# Altium project PSLink_v2.PrjPcb (part 2 of 2)

## Sheet power-sheet.SchDoc: Power Regulator
size 420 x 297 mm; CheckedBy: E.Orzes F.Martina S.Baron; CompanyName: CERN; DrawnBy: E.Orzes; Organization: CERN; Address1: European Organization for Nuclear Research; Address2: CH-1211 Genève 23 - Switzerland; Revision: 1.0; SheetNumber: 7; SheetTotal: 7; Projet: Phase Stable Link; DivGrp: EP-ESE; Designer: E.Orzes; ModifiedDate: -
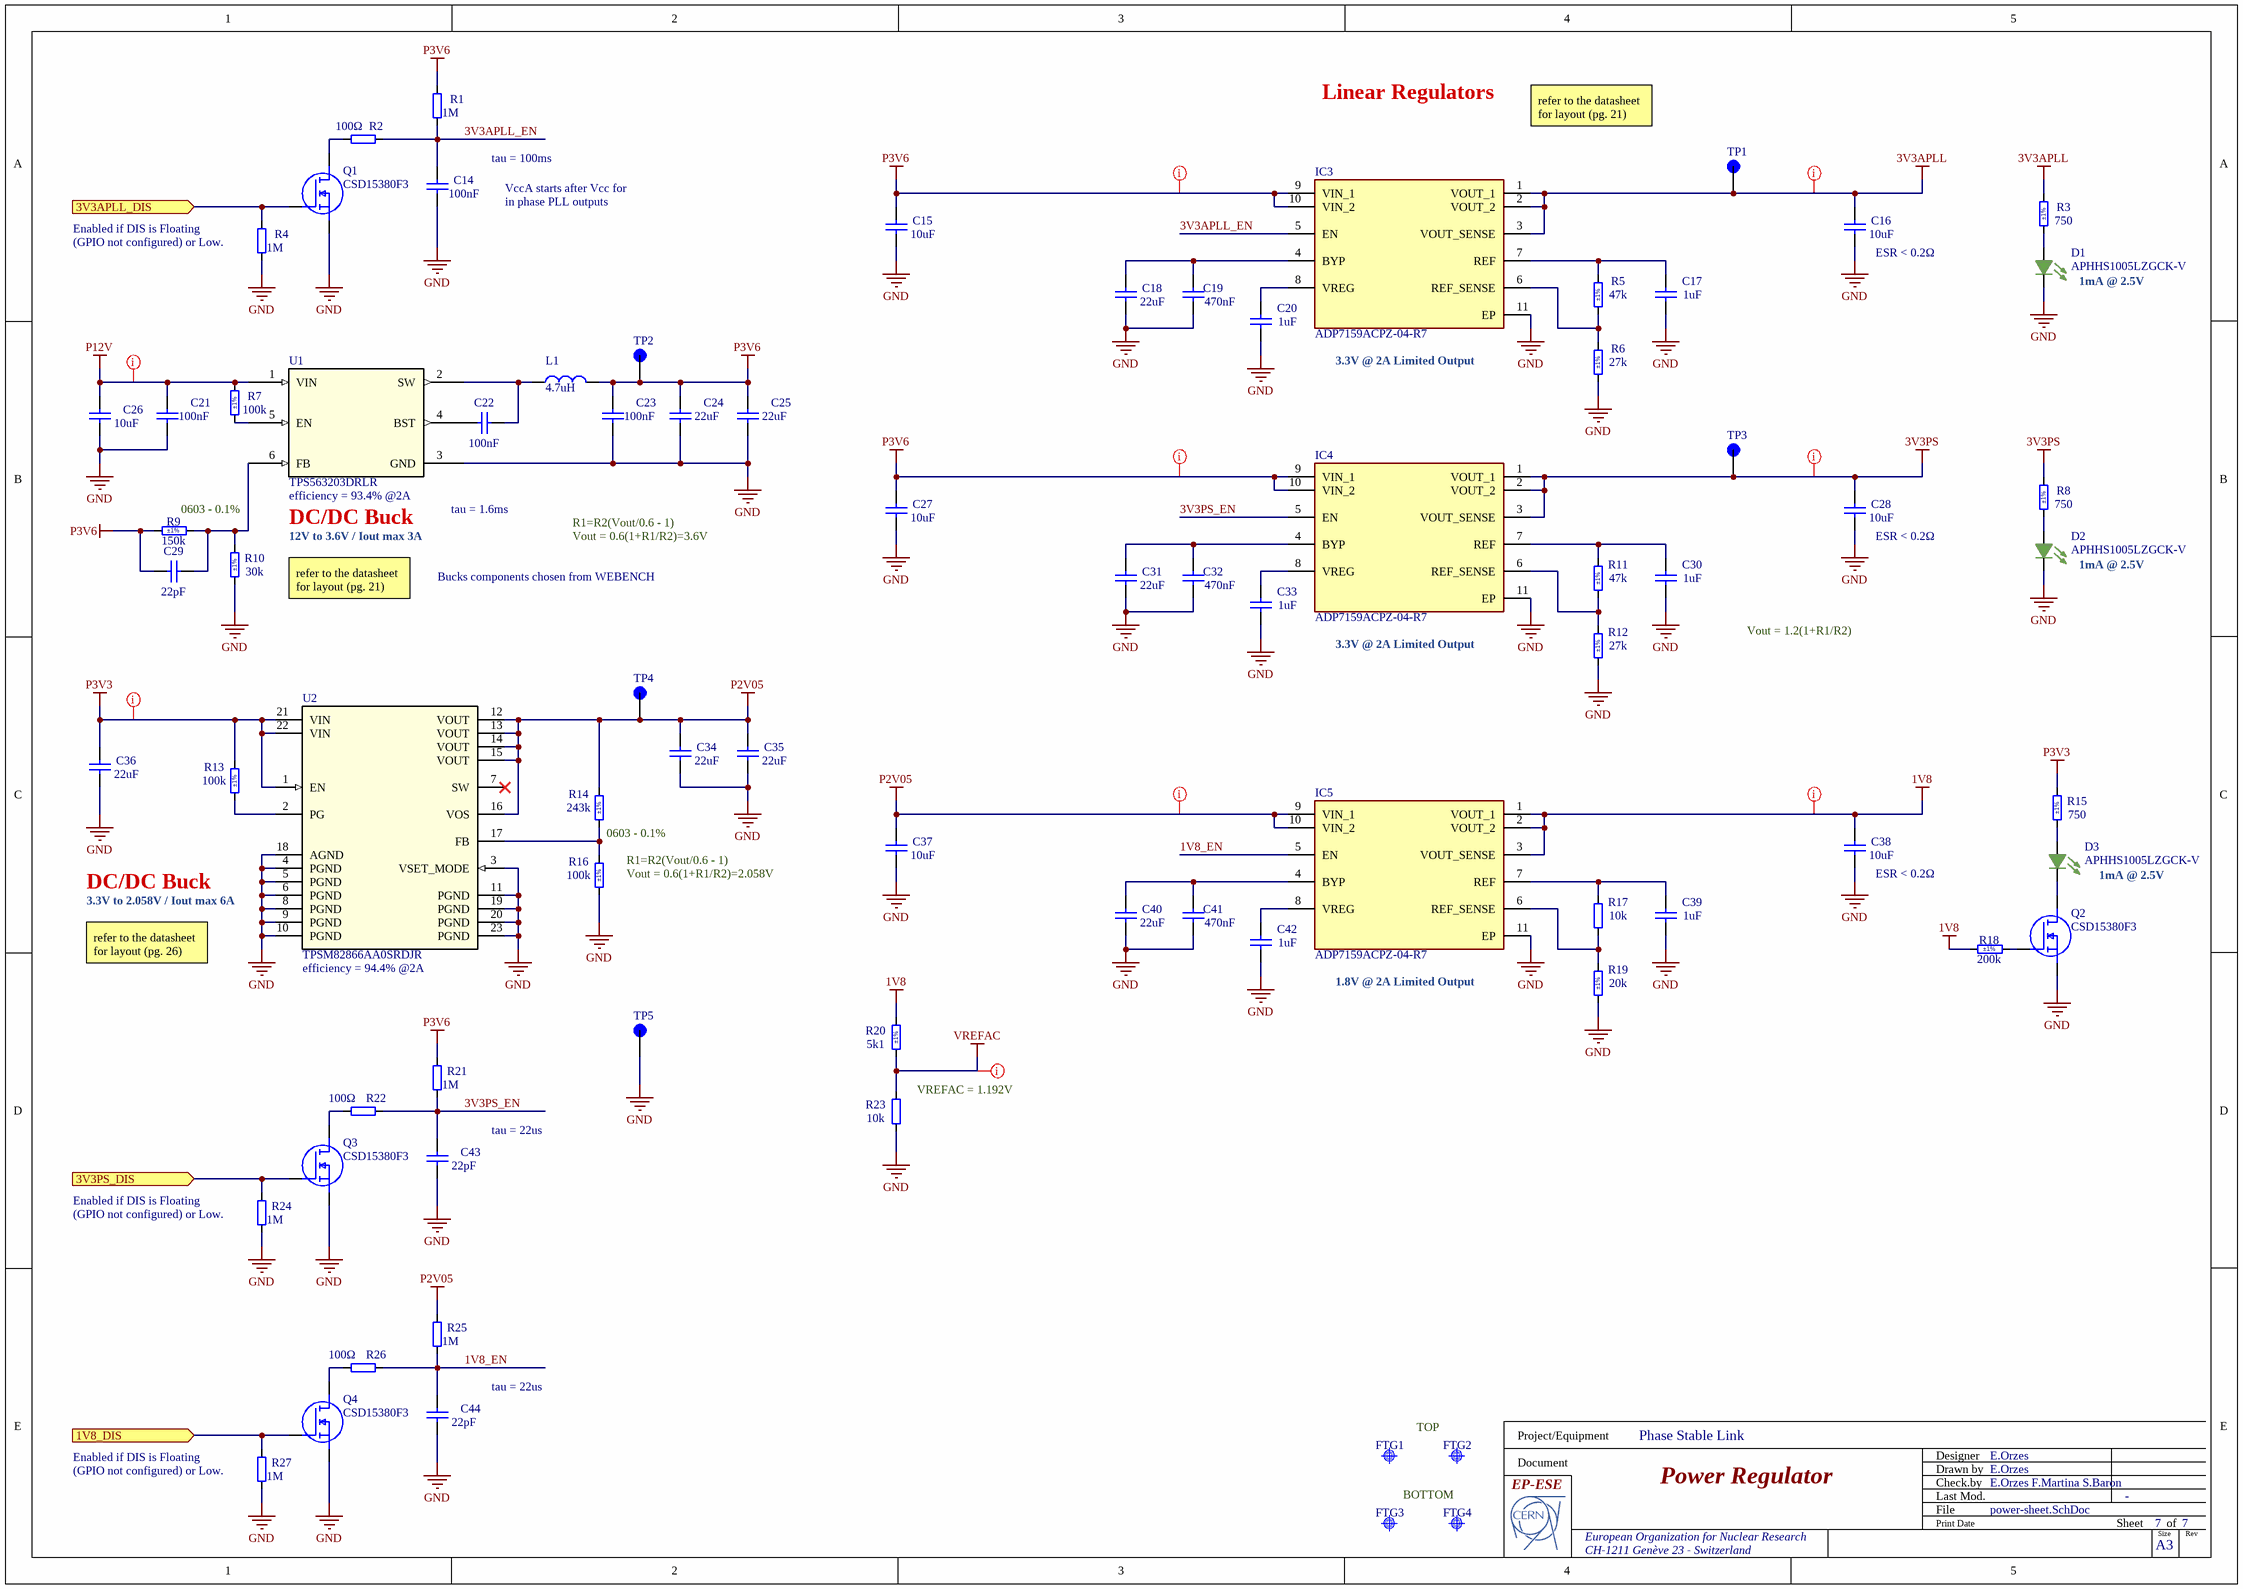
[diagram p4: power-sheet.SchDoc]

### Parts
C14  100nF  [MURATA_HI_DENSITY_0201]
C15  10uF  [CAPC1608X87N]
C16  10uF  [CAPC1608X87N]
C17  1uF  [CAPC1005X55N]
C18  22uF  [MURATA_HI_DENSITY_0402_CAP]
C19  470nF  [CAPC0510X04N]
C20  1uF  [CAPC1005X55N]
C21  100nF  [MURATA_HI_DENSITY_0402_CAP]
C22  100nF  [MURATA_HI_DENSITY_0402_CAP]
C23  100nF  [MURATA_HI_DENSITY_0402_CAP]
C24  22uF  [MURATA_HI_DENSITY_0402_CAP]
C25  22uF  [MURATA_HI_DENSITY_0402_CAP]
C26  10uF  [CAPC1608X87N]
C27  10uF  [CAPC1608X87N]
C28  10uF  [CAPC1608X87N]
C29  22pF  [MURATA_HI_DENSITY_0402_CAP]
C30  1uF  [CAPC1005X55N]
C31  22uF  [MURATA_HI_DENSITY_0402_CAP]
C32  470nF  [CAPC0510X04N]
C33  1uF  [CAPC1005X55N]
C34  22uF  [MURATA_HI_DENSITY_0402_CAP]
C35  22uF  [MURATA_HI_DENSITY_0402_CAP]
C36  22uF  [MURATA_HI_DENSITY_0402_CAP]
C37  10uF  [CAPC1608X87N]
C38  10uF  [CAPC1608X87N]
C39  1uF  [CAPC1005X55N]
C40  22uF  [MURATA_HI_DENSITY_0402_CAP]
C41  470nF  [CAPC0510X04N]
C42  1uF  [CAPC1005X55N]
C43  22pF  [MURATA_HI_DENSITY_0402_CAP]
C44  22pF  [MURATA_HI_DENSITY_0402_CAP]
D1  APHHS1005LZGCK-V  [LED_APHHS1005LZGCK-V]
D2  APHHS1005LZGCK-V  [LED_APHHS1005LZGCK-V]
D3  APHHS1005LZGCK-V  [LED_APHHS1005LZGCK-V]
FTG1  Use only in PCB  [FIDUCIAL_TOP_C100-200]  (value not drawn)
FTG2  Use only in PCB  [FIDUCIAL_TOP_C100-200]  (value not drawn)
FTG3  Use only in PCB  [FIDUCIAL_TOP_C100-200]  (value not drawn)
FTG4  Use only in PCB  [FIDUCIAL_TOP_C100-200]  (value not drawn)
IC3  ADP7159ACPZ-04-R7  [SON50P300X300X85-11N-D]
IC4  ADP7159ACPZ-04-R7  [SON50P300X300X85-11N-D]
IC5  ADP7159ACPZ-04-R7  [SON50P300X300X85-11N-D]
L1  4.7uH  [DFE322520FD1R0MP2]
Q1  CSD15380F3  [CSD15380F3]
Q2  CSD15380F3  [CSD15380F3]
Q3  CSD15380F3  [CSD15380F3]
Q4  CSD15380F3  [CSD15380F3]
R1  1M  [MURATA_HI_DENSITY_0201]
R2  100Ω  [MURATA_HI_DENSITY_0201]
R3  750  Tolerance: ±1%  [RESC1005X40N]
R4  1M  [MURATA_HI_DENSITY_0201]
R5  47k  Tolerance: ±1%  [RESC1005X40N]
R6  27k  Tolerance: ±1%  [RESC1005X40N]
R7  100k  Tolerance: ±1%  [RESC1608X55N]
R8  750  Tolerance: ±1%  [RESC1005X40N]
R9  150k  Tolerance: ±1%  [RESC1608X55N]
R10  30k  Tolerance: ±1%  [RESC1608X55N]
R11  47k  Tolerance: ±1%  [RESC1005X40N]
R12  27k  Tolerance: ±1%  [RESC1005X40N]
R13  100k  Tolerance: ±1%  [RESC1608X55N]
R14  243k  Tolerance: ±1%  [RESC1608X55N]
R15  750  Tolerance: ±1%  [RESC1005X40N]
R16  100k  Tolerance: ±1%  [RESC1608X55N]
R17  10k  [MURATA_HI_DENSITY_0201]
R18  200k  Tolerance: ±1%  [RESC1005X40N]
R19  20k  Tolerance: ±1%  [RESC1005X40N]
R20  5k1  Tolerance: ±1%  [RESC1005X40N]
R21  1M  [MURATA_HI_DENSITY_0201]
R22  100Ω  [MURATA_HI_DENSITY_0201]
R23  10k  [MURATA_HI_DENSITY_0201]
R24  1M  [MURATA_HI_DENSITY_0201]
R25  1M  [MURATA_HI_DENSITY_0201]
R26  100Ω  [MURATA_HI_DENSITY_0201]
R27  1M  [MURATA_HI_DENSITY_0201]
TP1  RCU-0C  [TP+195X110]  (value not drawn)
TP2  RCU-0C  [TP+195X110]  (value not drawn)
TP3  RCU-0C  [TP+195X110]  (value not drawn)
TP4  RCU-0C  [TP+195X110]  (value not drawn)
TP5  RCU-0C  [TP+195X110]  (value not drawn)
U1  TPS563203DRLR  [SOT_07SDRLR_TEX]
U2  TPSM82866AA0SRDJR  [RDJ0023A-MFG]

### Ports
1V8_DIS (in), 3V3APLL_DIS (in), 3V3PS_DIS (in)

### Nets
1V8: C38.2 IC5.1(VOUT_1) IC5.2(VOUT_2) IC5.3(VOUT_SENSE) R18.1 R20.2
3V3APLL: C16.2 IC3.1(VOUT_1) IC3.2(VOUT_2) IC3.3(VOUT_SENSE) R3.2 TP1.1(TP)
3V3PS: C28.2 IC4.1(VOUT_1) IC4.2(VOUT_2) IC4.3(VOUT_SENSE) R8.2 TP3.1(TP)
GND: C14.1 C15.1 C16.1 C17.1 C18.1 C19.1 C20.1 C21.2 C23.2 C24.1 C25.1 C26.1 C27.1 C28.1 C30.1 C31.1 C32.1 C33.1 C34.1 C35.1 C36.1 C37.1 C38.1 C39.1 C40.1 C41.1 C42.1 C43.2 C44.2 D1.1(C) D2.1(C) IC3.11(EP) IC4.11(EP) IC5.11(EP) Q1.2(S) Q2.2(S) Q3.2(S) Q4.2(S) R4.2 R6.1 R10.1 R12.1 R16.1 R19.1 R23.1 R24.2 R27.2 TP5.1(TP) U1.3(GND) U2.3(VSET_MODE) U2.4(PGND) U2.5(PGND) U2.6(PGND) U2.8(PGND) U2.9(PGND) U2.10(PGND) U2.11(PGND) U2.18(AGND) U2.19(PGND) U2.20(PGND) U2.23(PGND)
P2V05: C34.2 C35.2 C37.2 IC5.9(VIN_1) IC5.10(VIN_2) R14.2 R25.1 TP4.1(TP) U2.12(VOUT) U2.13(VOUT) U2.14(VOUT) U2.15(VOUT) U2.16(VOS)
P3V3: C36.2 R13.2 R15.2 U2.1(EN) U2.21(VIN) U2.22(VIN)
P3V6: C15.2 C23.1 C24.2 C25.2 C27.2 C29.2 IC3.9(VIN_1) IC3.10(VIN_2) IC4.9(VIN_1) IC4.10(VIN_2) L1.2 R1.1 R9.1 R21.1 TP2.1(TP)
P12V: C21.1 C26.2 R7.2 U1.1(VIN)
VREFAC: R20.1 R23.2
1V8_DIS: Q4.1(G) R27.1 ; port 1V8_DIS
1V8_EN: C44.1 IC5.5(EN) R25.2 R26.2
3V3_APLL_DIS: Q1.1(G) R4.1 ; port 3V3APLL_DIS
3V3_PS_DIS: Q3.1(G) R24.1 ; port 3V3PS_DIS
3V3APLL_EN: C14.2 IC3.5(EN) R1.2 R2.2
3V3PS_EN: C43.1 IC4.5(EN) R21.2 R22.2
NetC17_2: C17.2 IC3.7(REF) R5.2
NetC18_2: C18.2 C19.2 IC3.4(BYP)
NetC20_2: C20.2 IC3.8(VREG)
NetC22_1: C22.1 L1.1 U1.2(SW)
NetC22_2: C22.2 U1.4(BST)
NetC29_1: C29.1 R9.2 R10.2 U1.6(FB)
NetC30_2: C30.2 IC4.7(REF) R11.2
NetC31_2: C31.2 C32.2 IC4.4(BYP)
NetC33_2: C33.2 IC4.8(VREG)
NetC39_2: C39.2 IC5.7(REF) R17.2
NetC40_2: C40.2 C41.2 IC5.4(BYP)
NetC42_2: C42.2 IC5.8(VREG)
NetD1_2: D1.2(A) R3.1
NetD2_2: D2.2(A) R8.1
NetD3_1: D3.1(C) Q2.3(D)
NetD3_2: D3.2(A) R15.1
NetIC3_6: IC3.6(REF_SENSE) R5.1 R6.2
NetIC4_6: IC4.6(REF_SENSE) R11.1 R12.2
NetIC5_6: IC5.6(REF_SENSE) R17.1 R19.2
NetQ1_3: Q1.3(D) R2.1
NetQ2_1: Q2.1(G) R18.2
NetQ3_3: Q3.3(D) R22.1
NetQ4_3: Q4.3(D) R26.1
NetR7_1: R7.1 U1.5(EN)
NetR13_1: R13.1 U2.2(PG)
NetR14_1: R14.1 R16.2 U2.17(FB)

Not connected (* = marked no-connect by the designer): U2 7(SW)*

### Layout directives
net class Power: 1V8, 3V3APLL, 3V3PS, P2V05, P3V3, P3V6, P12V, VREFAC

### Notes on the sheet
- Linear Regulators
- refer to the datasheet for layout (pg. 21)
- tau = 100ms
- (near R4) Enabled if DIS is Floating (GPIO not configured) or Low.
- VccA starts after Vcc for in phase PLL outputs
- (near C16) ESR < 0.2Ω
- 1mA @ 2.5V
- (near IC3) 3.3V @ 2A Limited Output
- (near R9) 0603 - 0.1%
- DC/DC Buck
- (near U1) efficiency = 93.4% @2A
- (near U1) tau = 1.6ms
- R1=R2(Vout/0.6 - 1)
- 12V to 3.6V / Iout max 3A
- Bucks components chosen from WEBENCH
- Vout = 0.6(1+R1/R2)=3.6V
- (near C28) ESR < 0.2Ω
- (near IC4) 3.3V @ 2A Limited Output
- Vout = 1.2(1+R1/R2)
- (near R14) 0603 - 0.1%
- (near U2) 3.3V to 2.058V / Iout max 6A
- (near R16) Vout = 0.6(1+R1/R2)=2.058V
- (near C38) ESR < 0.2Ω
- refer to the datasheet for layout (pg. 26)
- (near U2) efficiency = 94.4% @2A
- (near IC5) 1.8V @ 2A Limited Output
- tau = 22us
- (near R23) VREFAC = 1.192V
- (near R24) Enabled if DIS is Floating (GPIO not configured) or Low.
- TOP
- (near R27) Enabled if DIS is Floating (GPIO not configured) or Low.
- BOTTOM
- Project/Equipment
- Document
- Designer
- Drawn by
- Check.by
- File
- Last Mod.
- Print Date
- Sheet
- Size
- A3
- of
- Rev

### Library data of the parts
C14 = C0201-100nF-high-density: GRM033R61C104KE14; Vmax: 16V; Value: 100nF
C15 C16 C26-C28 C37 C38 = CC0603_10UF_6.3V_20%_X5R: as C101 on sheet PLL; Part Number: CC0603_10UF_6.3V_20%_X5R; Component Kind: Standard; Component Type: Standard; Pin Count: 2; Value: 10uF; Status: Preferred; Manufacturer Part Number: CC0603_10uF_6.3V_20%_X5R; Case: 0603; Mounted: Yes; Socket: No; SMD: Yes; Sense: No; Manufacturer1 Example: KEMET; Manufacturer1 ComponentHeight: 0.95mm; HelpURL: \\cern.ch\dfs\Applications\Altium\Datasheets\CC0603_X5R_KEMET.pdf; Author: CERN DEM JLC; CreateDate: 03/12/2007; LatestRevisionDate: 03/12/2007
C17 C20 C30 C33 C39 C42 = CC0402_1UF_16V_10%_X5R: GRM153B30J105ME15; Part Description: SMD Multilayer Chip Ceramic Capacitor; Manufacturer: GENERIC; Manufacturer1 Part Number: C1005X5R1C105KT; Voltage: 16V; TC: X5R; Tolerance: ±10%; Part Number: CC0402_1UF_16V_10%_X5R; Component Kind: Standard; Component Type: Standard; Pin Count: 2; Value: 1uF; Status: Preferred; Manufacturer Part Number: CC0402_1UF_16V_10%_X5R; Case: 0402; Mounted: Yes; Socket: No; SMD: Yes; Sense: No; Manufacturer1 Example: TDK; Manufacturer1 ComponentHeight: 0.55mm; HelpURL: \\cern.ch\dfs\Applications\Altium\Datasheets\CC0402_X5R_TDK_C.pdf; Author: CERN DEM JLC; CreateDate: 10/25/2012; LatestRevisionDate: 10/25/2012
C18 C24 C25 C31 C34-C36 C40 = C0402-22uF-high-density: GRM155R60J226ME11; Vmax: 6.3V; Value: 22uF
C19 C32 C41 = Capacitor - non polarized: LLL153C70G474ME17; Value: 470nF
C21-C23 = C0402-22uF-high-density: GRM155R71E104KE14; Value: 22uF; Vmax: 6.3V
C29 C43 C44 = C0402-22uF-high-density: C0402C220J4GACTU; Value: 22uF; Vmax: 6.3V
D1-D3 = APHHS1005LZGCK-V: Led Green 0402 2mA 2.65V 40mcd 102mW; MF: Kingbright Corporation; SnapEDA_Link: https://www.snapeda.com/parts/APHHS1005LZGCK-V/Kingbright/view-part/?ref=snap; Package: 0402 Kingbright Corporation; Value: *; MP: APHHS1005LZGCK-V; Check_prices: https://www.snapeda.com/parts/APHHS1005LZGCK-V/Kingbright/view-part/?ref=eda
FTG1-FTG4 = FIDUCIAL_TARGET_C100-200: Fiducial Target; Part Description: Round Fiducial Target, Top Layer, 1.0mm, Top Solder 2.0mm, Keepout =2.0mm; Mounted: No; Part Number: FIDUCIAL_TARGET_C100-200; Component Kind: Standard (No BOM); Component Type: Standard (No BOM); Pin Count: 1; Family: Fiducial; Socket: No; SMD: Yes; Sense: No; Status: None; ComponentHeight: 0mm; HelpURL: Undefined; Author: CERN DEM JLC; CreateDate: 09/02/2010; LatestRevisionDate: 04/04/2012; PackageDescription: Round Fiducial Target, Top Layer, 1.0mm, Top Solder 2.0mm, Keepout =2.0mm
IC3-IC5 = ADP7159ACPZ-04-R7: Integrated Circuit; Manufacturer_Name: Analog Devices; Datasheet Link: https://www.analog.com/media/en/technical-documentation/data-sheets/ADP7159.pdf; Height: 0.85mm; Manufacturer_Part_Number: ADP7159ACPZ-04-R7; Mouser Part Number: 584-ADP7159ACPZ04R7; Mouser Price/Stock: https://www.mouser.co.uk/ProductDetail/Analog-Devices/ADP7159ACPZ-04-R7?qs=JeIcUl65ClBXEAZRPtHUVQ%3D%3D; Arrow Part Number: ADP7159ACPZ-04-R7; Arrow Price/Stock: https://www.arrow.com/en/products/adp7159acpz-04-r7/analog-devices
L1 = DFE322520FD-4R7M=P2: Inductor; Manufacturer_Name: Murata Electronics; Datasheet Link: https://search.murata.co.jp/Ceramy/image/img/P02/J(E)TE243A-9104.pdf; Height: 2mm; Manufacturer_Part_Number: DFE322520FD-4R7M=P2; Mouser Part Number: 81-DFE322520FD4R7MP2; Mouser Price/Stock: https://www.mouser.co.uk/ProductDetail/Murata-Electronics/DFE322520FD-4R7M%3dP2?qs=17u8i%2FzlE8%252BgAY54mivQ1g%3D%3D; Arrow Part Number: DFE322520FD-4R7M=P2; Arrow Price/Stock: https://www.arrow.com/en/products/dfe322520fd-4r7mp2/murata-manufacturing?region=nac
Q1-Q4 = CSD15380F3: MOSFET (N-Channel); Manufacturer_Name: Texas Instruments; Datasheet Link: https://www.ti.com/lit/ds/symlink/csd15380f3.pdf?ts=1641221366106&ref_url=https%253A%252F%252Fwww.google.com%252F; Height: 0.35mm; Manufacturer_Part_Number: CSD15380F3; Mouser Part Number: 595-CSD15380F3; Mouser Price/Stock: https://www.mouser.co.uk/ProductDetail/Texas-Instruments/CSD15380F3?qs=zEmsApcVOkXP46xhm0edmA%3D%3D; Arrow Part Number: CSD15380F3; Arrow Price/Stock: https://www.arrow.com/en/products/csd15380f3/texas-instruments?region=nac
R1 R4 R17 R21 R23-R25 R27 = R0201-100ohm-high-density: Resistor 10k; Value: 100Ω
R2 R22 R26 = R0201-100ohm-high-density: Resistor; Value: 100Ω
R3 R8 R15 = R0402_750R_1%_0.0625W_100PPM: Resistor - 1%; Part Description: General Purpose Thick Film Chip Resistor; Manufacturer: GENERIC; Manufacturer1 Part Number: 232270677501L; TC: ±100ppm/°C; PressFit: No; Part Number: R0402_750R_1%_0.0625W_100PPM; Component Kind: Standard; Component Type: Standard; Pin Count: 2; Value: 750; Status: Not Recommended; Power: 0.0625W; Manufacturer Part Number: R0402_750R_1%_0.0625W_100PPM; Case: 0402; Mounted: Yes; Sense: No; Socket: No; SMD: Yes; Manufacturer1 Example: YAGEO PHYCOMP; Manufacturer1 ComponentHeight: 0.4mm; HelpURL: \\cern.ch\dfs\Applications\Altium\Datasheets\R0402_Phycomp_RC0402.pdf; Author: CERN DEM JLC; CreateDate: 12/3/2007; LatestRevisionDate: 10/17/2012
R5 R11 = R0402_47K_1%_0.0625W_100PPM: Resistor - 1%; Part Description: General Purpose Thick Film Chip Resistor; Manufacturer: GENERIC; Manufacturer1 Part Number: 232270674703L; TC: ±100ppm/°C; PressFit: No; Part Number: R0402_47K_1%_0.0625W_100PPM; Component Kind: Standard; Component Type: Standard; Pin Count: 2; Value: 47k; Status: Not Recommended; Power: 0.0625W; Manufacturer Part Number: R0402_47K_1%_0.0625W_100PPM; Case: 0402; Mounted: Yes; Sense: No; Socket: No; SMD: Yes; Manufacturer1 Example: YAGEO PHYCOMP; Manufacturer1 ComponentHeight: 0.4mm; HelpURL: \\cern.ch\dfs\Applications\Altium\Datasheets\R0402_Phycomp_RC0402.pdf; Author: CERN DEM JLC; CreateDate: 12/3/2007; LatestRevisionDate: 10/17/2012
R6 R12 = R0402_27K_1%_0.0625W_100PPM: Resistor - 1%; Part Description: General Purpose Thick Film Chip Resistor; Manufacturer: GENERIC; Manufacturer1 Part Number: 232270672703L; TC: ±100ppm/°C; PressFit: No; Part Number: R0402_27K_1%_0.0625W_100PPM; Component Kind: Standard; Component Type: Standard; Pin Count: 2; Value: 27k; Status: Not Recommended; Power: 0.0625W; Manufacturer Part Number: R0402_27K_1%_0.0625W_100PPM; Case: 0402; Mounted: Yes; Sense: No; Socket: No; SMD: Yes; Manufacturer1 Example: YAGEO PHYCOMP; Manufacturer1 ComponentHeight: 0.4mm; HelpURL: \\cern.ch\dfs\Applications\Altium\Datasheets\R0402_Phycomp_RC0402.pdf; Author: CERN DEM JLC; CreateDate: 12/3/2007; LatestRevisionDate: 10/17/2012
R7 R13 R14 R16 = R0603_30K_1%_0.1W_100PPM: Resistor - 1%; Part Description: General Purpose Thick Film Chip Resistor; Manufacturer: GENERIC; Manufacturer1 Part Number: NRC06F3002TRF; Value: 30k; Power: 0.1W; TC: ±100ppm/°C; PressFit: No; Part Number: R0603_30K_1%_0.1W_100PPM; Component Kind: Standard; Component Type: Standard; Pin Count: 2; Status: Preferred; Manufacturer Part Number: R0603_30K_1%_0.1W_100PPM; Case: 0603; Mounted: Yes; Sense: No; Socket: No; SMD: Yes; Manufacturer1 Example: NIC COMPONENT; Manufacturer1 ComponentHeight: 0.55mm; HelpURL: \\cern.ch\dfs\Applications\Altium\Datasheets\R0603_NIC_NRC.pdf; Author: CERN DEM JLC; CreateDate: 12/3/2007; LatestRevisionDate: 3/13/2008
R9 = R0603_150K_1%_0.1W_100PPM: Resistor - 1%; Part Description: General Purpose Thick Film Chip Resistor; Manufacturer: GENERIC; Manufacturer1 Part Number: NRC06F1503TRF; Power: 0.1W; TC: ±100ppm/°C; PressFit: No; Part Number: R0603_150K_1%_0.1W_100PPM; Component Kind: Standard; Component Type: Standard; Pin Count: 2; Value: 150k; Status: Preferred; Manufacturer Part Number: R0603_150K_1%_0.1W_100PPM; Case: 0603; Mounted: Yes; Sense: No; Socket: No; SMD: Yes; Manufacturer1 Example: NIC COMPONENT; Manufacturer1 ComponentHeight: 0.55mm; HelpURL: \\cern.ch\dfs\Applications\Altium\Datasheets\R0603_NIC_NRC.pdf; Author: CERN DEM JLC; CreateDate: 12/3/2007; LatestRevisionDate: 3/13/2008
R10 = R0603_30K_1%_0.1W_100PPM: Resistor - 1%; Part Description: General Purpose Thick Film Chip Resistor; Manufacturer: GENERIC; Manufacturer1 Part Number: NRC06F3002TRF; Power: 0.1W; TC: ±100ppm/°C; PressFit: No; Part Number: R0603_30K_1%_0.1W_100PPM; Component Kind: Standard; Component Type: Standard; Pin Count: 2; Value: 30k; Status: Preferred; Manufacturer Part Number: R0603_30K_1%_0.1W_100PPM; Case: 0603; Mounted: Yes; Sense: No; Socket: No; SMD: Yes; Manufacturer1 Example: NIC COMPONENT; Manufacturer1 ComponentHeight: 0.55mm; HelpURL: \\cern.ch\dfs\Applications\Altium\Datasheets\R0603_NIC_NRC.pdf; Author: CERN DEM JLC; CreateDate: 12/3/2007; LatestRevisionDate: 3/13/2008
R18 = R0402_200K_1%_0.0625W_100PPM: Resistor - 1%; Part Description: General Purpose Thick Film Chip Resistor; Manufacturer: GENERIC; Manufacturer1 Part Number: 232270672004L; TC: ±100ppm/°C; PressFit: No; Part Number: R0402_200K_1%_0.0625W_100PPM; Component Kind: Standard; Component Type: Standard; Pin Count: 2; Value: 200k; Status: Not Recommended; Power: 0.0625W; Manufacturer Part Number: R0402_200K_1%_0.0625W_100PPM; Case: 0402; Mounted: Yes; Sense: No; Socket: No; SMD: Yes; Manufacturer1 Example: YAGEO PHYCOMP; Manufacturer1 ComponentHeight: 0.4mm; HelpURL: \\cern.ch\dfs\Applications\Altium\Datasheets\R0402_Phycomp_RC0402.pdf; Author: CERN DEM JLC; CreateDate: 12/3/2007; LatestRevisionDate: 10/17/2012
R19 = R0402_20K_1%_0.0625W_100PPM: Resistor - 1%; Part Description: General Purpose Thick Film Chip Resistor; Manufacturer: GENERIC; Manufacturer1 Part Number: 232270672003L; TC: ±100ppm/°C; PressFit: No; Part Number: R0402_20K_1%_0.0625W_100PPM; Component Kind: Standard; Component Type: Standard; Pin Count: 2; Value: 20k; Status: Not Recommended; Power: 0.0625W; Manufacturer Part Number: R0402_20K_1%_0.0625W_100PPM; Case: 0402; Mounted: Yes; Sense: No; Socket: No; SMD: Yes; Manufacturer1 Example: YAGEO PHYCOMP; Manufacturer1 ComponentHeight: 0.4mm; HelpURL: \\cern.ch\dfs\Applications\Altium\Datasheets\R0402_Phycomp_RC0402.pdf; Author: CERN DEM JLC; CreateDate: 12/3/2007; LatestRevisionDate: 10/17/2012
R20 = R0402_5K1_1%_0.0625W_100PPM: Resistor - 1%; Part Description: General Purpose Thick Film Chip Resistor; Manufacturer: GENERIC; Manufacturer1 Part Number: 232270675102L; TC: ±100ppm/°C; PressFit: No; Part Number: R0402_5K1_1%_0.0625W_100PPM; Component Kind: Standard; Component Type: Standard; Pin Count: 2; Value: 5k1; Status: Not Recommended; Power: 0.0625W; Manufacturer Part Number: R0402_5K1_1%_0.0625W_100PPM; Case: 0402; Mounted: Yes; Sense: No; Socket: No; SMD: Yes; Manufacturer1 Example: YAGEO PHYCOMP; Manufacturer1 ComponentHeight: 0.4mm; HelpURL: \\cern.ch\dfs\Applications\Altium\Datasheets\R0402_Phycomp_RC0402.pdf; Author: CERN DEM JLC; CreateDate: 03/12/2007; LatestRevisionDate: 17/10/2012
TP1-TP5 = RCU-0C: as TP9 on sheet PLL; Package: None; Price: None; Value: *; MP: RCU-0C; Availability: Unavailable
U1 = TPS563203DRLR: No Description Available; Mfr_Name: Texas Instruments; Type: Power Management; RefDes: RefDes
U2 = XPSM82866AA0SRDJR: No Description Available; Mfr_Name: Texas Instruments; TYPE: TYPE; RefDes: RefDes

## Sheet FMC.SchDoc
size 420 x 297 mm; SheetNumber: 4; SheetTotal: 7
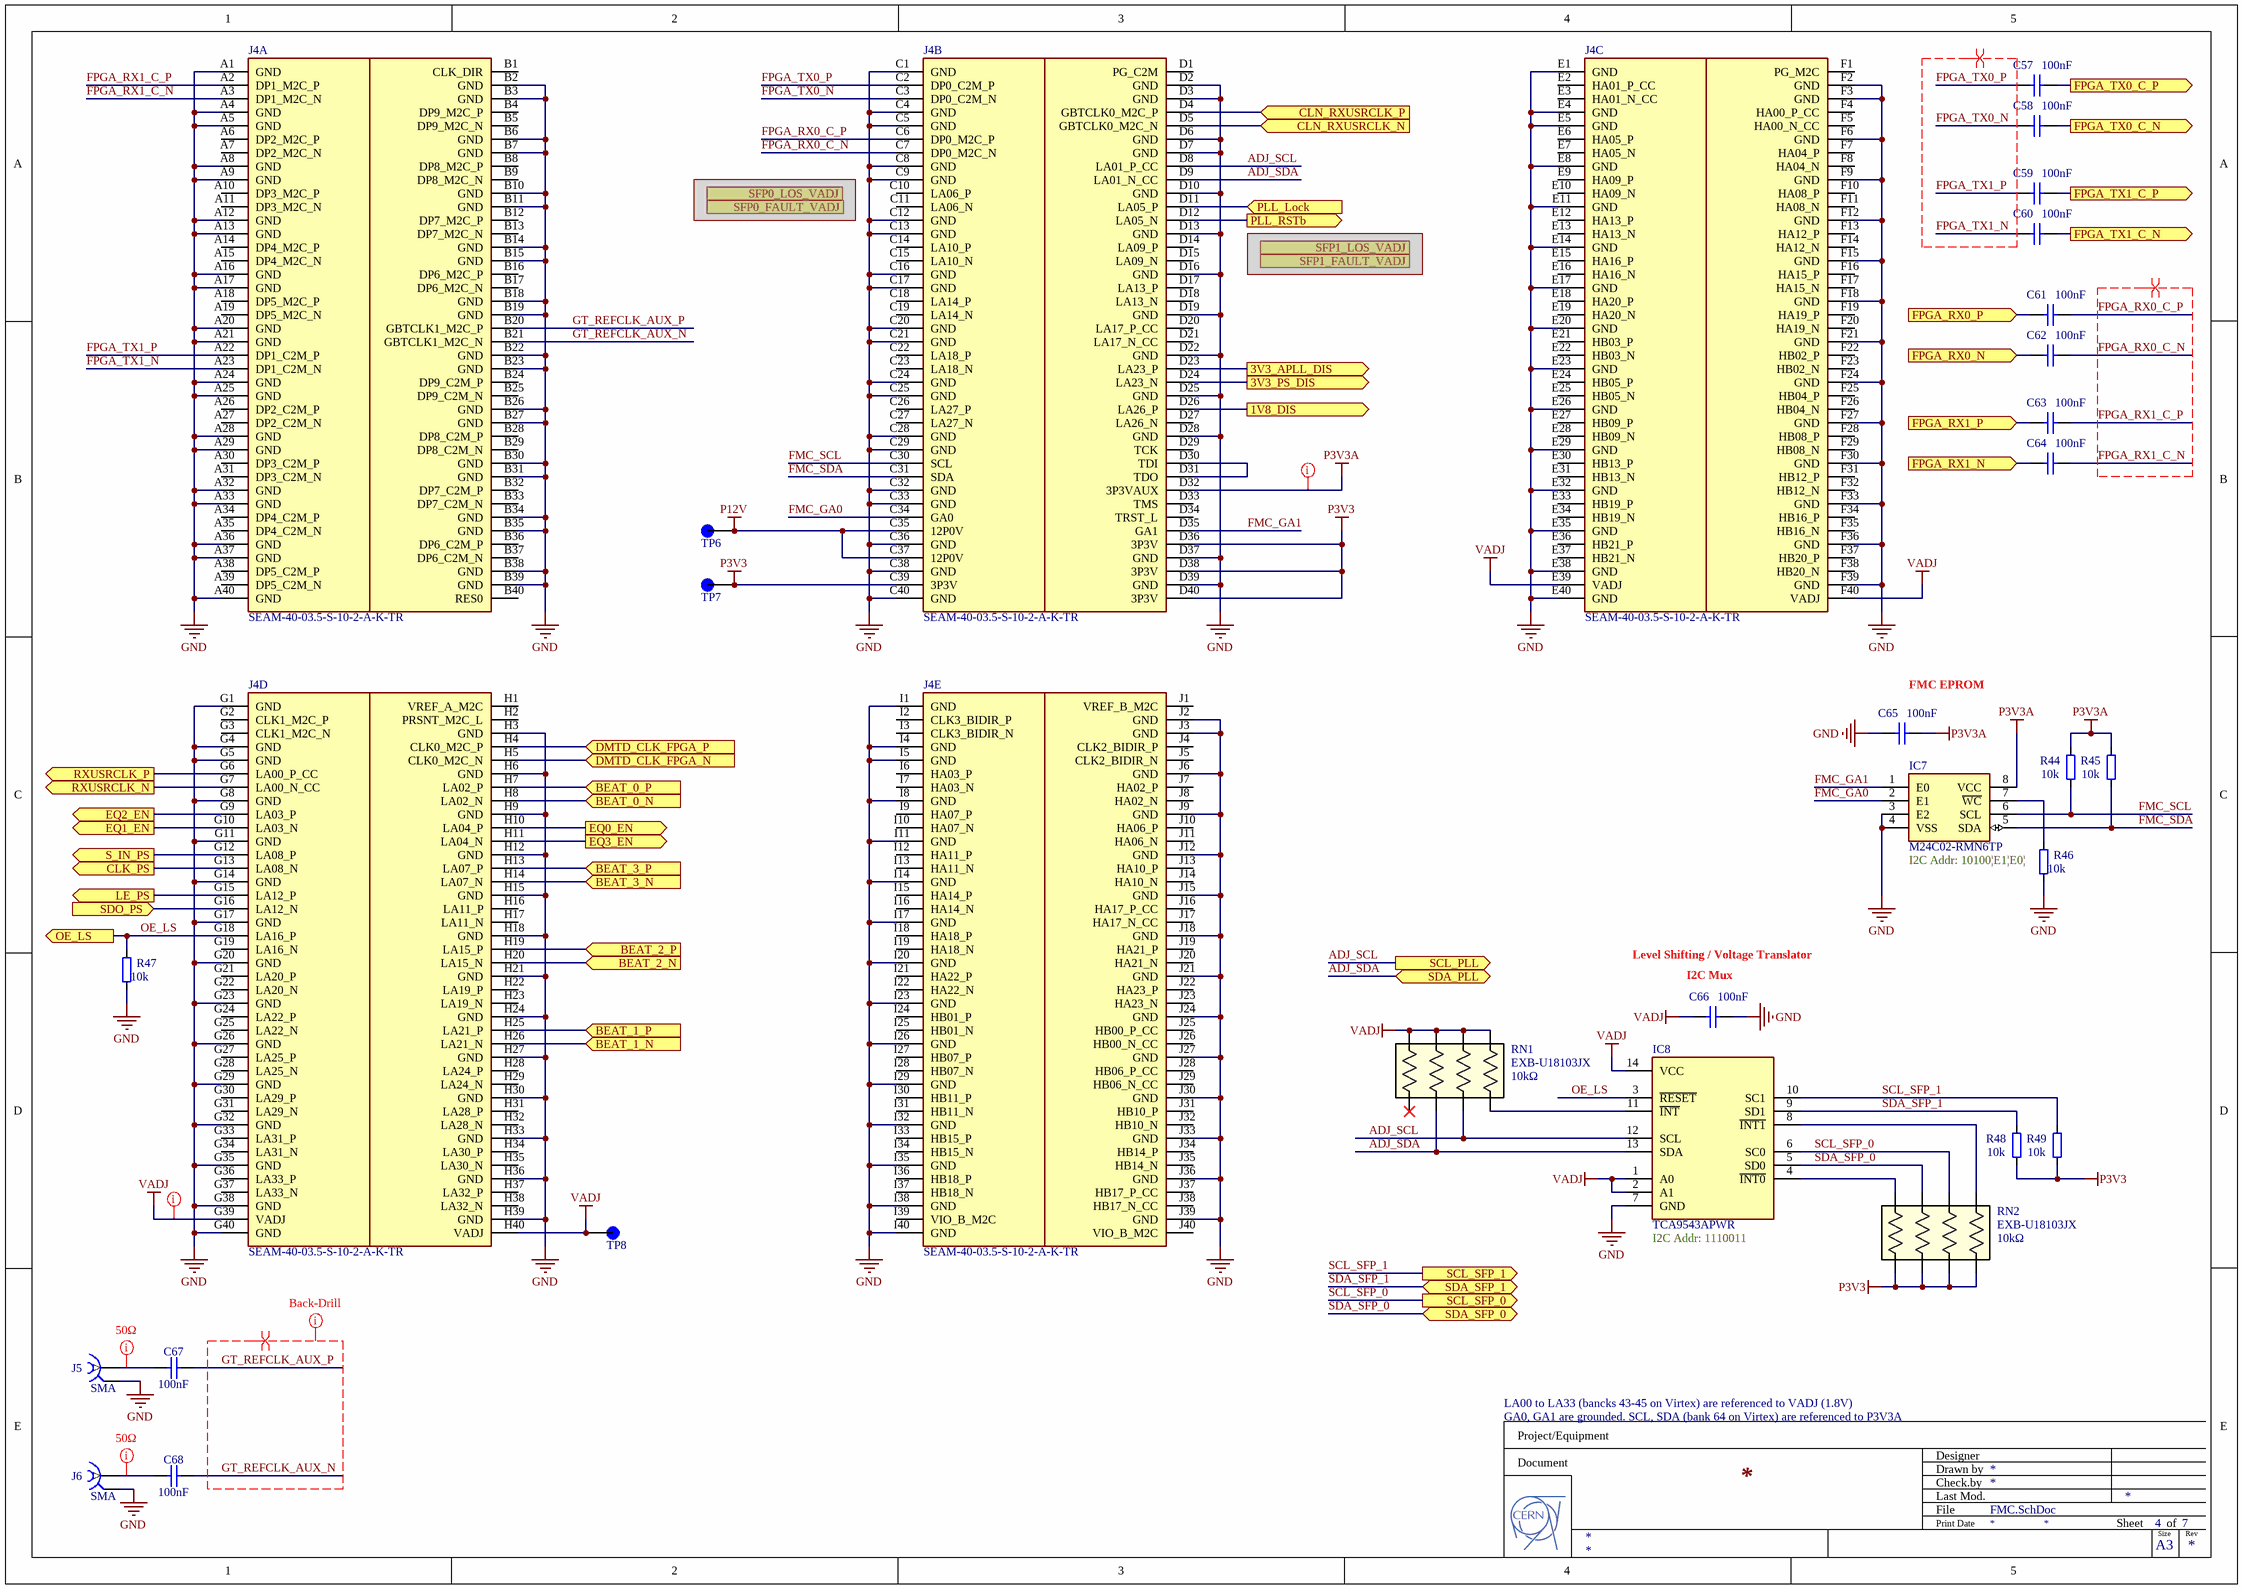
[diagram p5: FMC.SchDoc]

### Parts
(Parts that share a designator on the sheet are numbered #1, #2 ... from top to bottom, then left to right.)
C57  100nF  [MURATA_HI_DENSITY_0201]
C58  100nF  [MURATA_HI_DENSITY_0201]
C59  100nF  [MURATA_HI_DENSITY_0201]
C60  100nF  [MURATA_HI_DENSITY_0201]
C61  100nF  [MURATA_HI_DENSITY_0201]
C62  100nF  [MURATA_HI_DENSITY_0201]
C63  100nF  [MURATA_HI_DENSITY_0201]
C64  100nF  [MURATA_HI_DENSITY_0201]
C65  100nF  [MURATA_HI_DENSITY_0201]
C66  100nF  [MURATA_HI_DENSITY_0201]
C67  100nF  [MURATA_HI_DENSITY_0201]
C68  100nF  [MURATA_HI_DENSITY_0201]
IC7  M24C02-RMN6TP  [SOIC127P600X175-8N]
IC8  TCA9543APWR  [SOP65P640X120-14N]
J4  SEAM-40-03.5-S-10-2-A-K-TR  [SAMTEC_SEAM-40-03.5-S-10-2-A-K-TR]  (parts A,B,C,D,E of 5)
J5  SMA  [SAMTEC_SMA-J-P-H-ST-MT1]
J6  SMA  [SAMTEC_SMA-J-P-H-ST-MT1]
R44  10k  [MURATA_HI_DENSITY_0201]
R45  10k  [MURATA_HI_DENSITY_0201]
R46  10k  [MURATA_HI_DENSITY_0201]
R47  10k  [MURATA_HI_DENSITY_0201]
R48  10k  [MURATA_HI_DENSITY_0201]
R49  10k  [MURATA_HI_DENSITY_0201]
RN1  EXB-U18103JX  [EXBU18]
RN2#1  EXB-U18103JX  [EXBU18]
TP6  RCU-0C  [TP+195X110]  (value not drawn)
TP7  RCU-0C  [TP+195X110]  (value not drawn)
TP8  RCU-0C  [TP+195X110]  (value not drawn)

### Ports
1V8_DIS (out), 3V3_APLL_DIS (out), 3V3_PS_DIS (out), BEAT_0_N (in), BEAT_0_P (in), BEAT_1_N (in), BEAT_1_P (in), BEAT_2_N (in), BEAT_2_P (in), BEAT_3_N (in), BEAT_3_P (in), CLK_PS (out), CLN_RXUSRCLK_N (in), CLN_RXUSRCLK_P (in), DMTD_CLK_FPGA_N (in), DMTD_CLK_FPGA_P (in), EQ0_EN (out), EQ1_EN (out), EQ2_EN (out), EQ3_EN (out), FPGA_RX0_N (in), FPGA_RX0_P (in), FPGA_RX1_N (in), FPGA_RX1_P (in), FPGA_TX0_C_N (out), FPGA_TX0_C_P (out), FPGA_TX1_C_N (out), FPGA_TX1_C_P (out), LE_PS (out), OE_LS (out), PLL_Lock (in), PLL_RSTb (out), RXUSRCLK_N (out), RXUSRCLK_P (out), S_IN_PS (out), SCL_PLL (out), SCL_SFP_0 (out), SCL_SFP_1 (out), SDA_PLL (bidir), SDA_SFP_0 (bidir), SDA_SFP_1 (bidir), SDO_PS (in), SFP0_FAULT_VADJ (in), SFP0_LOS_VADJ (in), SFP1_FAULT_VADJ (in), SFP1_LOS_VADJ (in)

### Nets
GND: C65.1 C66.1 IC7.3(E2) IC7.4(VSS) IC8.7(GND) J4.A1(GND) J4.A4(GND) J4.A5(GND) J4.A8(GND) J4.A9(GND) J4.A12(GND) J4.A13(GND) J4.A16(GND) J4.A17(GND) J4.A20(GND) J4.A21(GND) J4.A24(GND) J4.A25(GND) J4.A28(GND) J4.A29(GND) J4.A32(GND) J4.A33(GND) J4.A36(GND) J4.A37(GND) J4.A40(GND) J4.B2(GND) J4.B3(GND) J4.B6(GND) J4.B7(GND) J4.B10(GND) J4.B11(GND) J4.B14(GND) J4.B15(GND) J4.B18(GND) J4.B19(GND) J4.B22(GND) J4.B23(GND) J4.B26(GND) J4.B27(GND) J4.B30(GND) J4.B31(GND) J4.B34(GND) J4.B35(GND) J4.B38(GND) J4.B39(GND) J4.C1(GND) J4.C4(GND) J4.C5(GND) J4.C8(GND) J4.C9(GND) J4.C12(GND) J4.C13(GND) J4.C16(GND) J4.C17(GND) J4.C20(GND) J4.C21(GND) J4.C24(GND) J4.C25(GND) J4.C28(GND) J4.C29(GND) J4.C32(GND) J4.C33(GND) J4.C36(GND) J4.C38(GND) J4.C40(GND) J4.D2(GND) J4.D3(GND) J4.D6(GND) J4.D7(GND) J4.D10(GND) J4.D13(GND) J4.D16(GND) J4.D19(GND) J4.D22(GND) J4.D25(GND) J4.D28(GND) J4.D37(GND) J4.D39(GND) J4.E1(GND) J4.E4(GND) J4.E5(GND) J4.E8(GND) J4.E11(GND) J4.E14(GND) J4.E17(GND) J4.E20(GND) J4.E23(GND) J4.E26(GND) J4.E29(GND) J4.E32(GND) J4.E35(GND) J4.E38(GND) J4.E40(GND) J4.F2(GND) J4.F3(GND) J4.F6(GND) J4.F9(GND) J4.F12(GND) J4.F15(GND) J4.F18(GND) J4.F21(GND) J4.F24(GND) J4.F27(GND) J4.F30(GND) J4.F33(GND) J4.F36(GND) J4.F39(GND) J4.G1(GND) J4.G4(GND) J4.G5(GND) J4.G8(GND) J4.G11(GND) J4.G14(GND) J4.G17(GND) J4.G20(GND) J4.G23(GND) J4.G26(GND) J4.G29(GND) J4.G32(GND) J4.G35(GND) J4.G38(GND) J4.G40(GND) J4.H3(GND) J4.H6(GND) J4.H9(GND) J4.H12(GND) J4.H15(GND) J4.H18(GND) J4.H21(GND) J4.H24(GND) J4.H27(GND) J4.H30(GND) J4.H33(GND) J4.H36(GND) J4.H39(GND) J4.I1(GND) J4.I4(GND) J4.I5(GND) J4.I8(GND) J4.I11(GND) J4.I14(GND) J4.I17(GND) J4.I20(GND) J4.I23(GND) J4.I26(GND) J4.I29(GND) J4.I32(GND) J4.I35(GND) J4.I38(GND) J4.I40(GND) J4.J2(GND) J4.J3(GND) J4.J6(GND) J4.J9(GND) J4.J12(GND) J4.J15(GND) J4.J18(GND) J4.J21(GND) J4.J24(GND) J4.J27(GND) J4.J30(GND) J4.J33(GND) J4.J36(GND) J4.J39(GND) J5.2 J6.2 R46.1 R47.1
P3V3: J4.C39(3P3V) J4.D36(3P3V) J4.D38(3P3V) J4.D40(3P3V) R48.1 R49.1 RN2#1.1 RN2#1.2 RN2#1.3 RN2#1.4 TP7.1(TP)
P3V3A: C65.2 IC7.8(VCC) J4.D32(3P3VAUX) R44.2 R45.2
P12V: J4.C35(12P0V) J4.C37(12P0V) TP6.1(TP)
VADJ: C66.2 IC8.1(A0) IC8.2(A1) IC8.14(VCC) J4.E39(VADJ) J4.F40(VADJ) J4.G39(VADJ) J4.H40(VADJ) RN1.5 RN1.6 RN1.7 RN1.8 TP8.1(TP)
1V8_DIS: J4.D26(LA26_P) ; port 1V8_DIS
3V3_APLL_DIS: J4.D23(LA23_P) ; port 3V3_APLL_DIS
3V3_PS_DIS: J4.D24(LA23_N) ; port 3V3_PS_DIS
ADJ_SCL: IC8.12(SCL) J4.D8(LA01_P_CC) RN1.3 ; port SCL_PLL
ADJ_SDA: IC8.13(SDA) J4.D9(LA01_N_CC) RN1.2 ; port SDA_PLL
BEAT_0_N: J4.H8(LA02_N) ; port BEAT_0_N
BEAT_0_P: J4.H7(LA02_P) ; port BEAT_0_P
BEAT_1_N: J4.H26(LA21_N) ; port BEAT_1_N
BEAT_1_P: J4.H25(LA21_P) ; port BEAT_1_P
BEAT_2_N: J4.H20(LA15_N) ; port BEAT_2_N
BEAT_2_P: J4.H19(LA15_P) ; port BEAT_2_P
BEAT_3_N: J4.H14(LA07_N) ; port BEAT_3_N
BEAT_3_P: J4.H13(LA07_P) ; port BEAT_3_P
CLK_PS: J4.G13(LA08_N) ; port CLK_PS
CLN_RXUSRCLK_N: J4.D5(GBTCLK0_M2C_N) ; port CLN_RXUSRCLK_N
CLN_RXUSRCLK_P: J4.D4(GBTCLK0_M2C_P) ; port CLN_RXUSRCLK_P
DMTD_CLK_FPGA_N: J4.H5(CLK0_M2C_N) ; port DMTD_CLK_FPGA_N
DMTD_CLK_FPGA_P: J4.H4(CLK0_M2C_P) ; port DMTD_CLK_FPGA_P
EQ0_EN: J4.H10(LA04_P) ; port EQ0_EN
EQ1_EN: J4.G10(LA03_N) ; port EQ1_EN
EQ2_EN: J4.G9(LA03_P) ; port EQ2_EN
EQ3_EN: J4.H11(LA04_N) ; port EQ3_EN
FMC_GA0: IC7.2(E1) J4.C34(GA0)
FMC_GA1: IC7.1(E0) J4.D35(GA1)
FMC_SCL: IC7.6(SCL) J4.C30(SCL) R44.1
FMC_SDA: IC7.5(SDA) J4.C31(SDA) R45.1
FPGA_RX0_C_N: C62.1 J4.C7(DP0_M2C_N)
FPGA_RX0_C_P: C61.1 J4.C6(DP0_M2C_P)
FPGA_RX0_N: C62.2 ; port FPGA_RX0_N
FPGA_RX0_P: C61.2 ; port FPGA_RX0_P
FPGA_RX1_C_N: C64.1 J4.A3(DP1_M2C_N)
FPGA_RX1_C_P: C63.1 J4.A2(DP1_M2C_P)
FPGA_RX1_N: C64.2 ; port FPGA_RX1_N
FPGA_RX1_P: C63.2 ; port FPGA_RX1_P
FPGA_TX0_C_N: C58.1 ; port FPGA_TX0_C_N
FPGA_TX0_C_P: C57.1 ; port FPGA_TX0_C_P
FPGA_TX0_N: C58.2 J4.C3(DP0_C2M_N)
FPGA_TX0_P: C57.2 J4.C2(DP0_C2M_P)
FPGA_TX1_C_N: C60.1 ; port FPGA_TX1_C_N
FPGA_TX1_C_P: C59.1 ; port FPGA_TX1_C_P
FPGA_TX1_N: C60.2 J4.A23(DP1_C2M_N)
FPGA_TX1_P: C59.2 J4.A22(DP1_C2M_P)
GT_REFCLK_AUX_N: C68.1 J4.B21(GBTCLK1_M2C_N)
GT_REFCLK_AUX_P: C67.1 J4.B20(GBTCLK1_M2C_P)
LE_PS: J4.G15(LA12_P) ; port LE_PS
OE_LS: IC8.3(~{RESET}) J4.G18(LA16_P) R47.2 ; port OE_LS
PLL_Lock: J4.D11(LA05_P) ; port PLL_Lock
PLL_RSTb: J4.D12(LA05_N) ; port PLL_RSTb
RXUSRCLK_N: J4.G7(LA00_N_CC) ; port RXUSRCLK_N
RXUSRCLK_P: J4.G6(LA00_P_CC) ; port RXUSRCLK_P
S_IN_PS: J4.G12(LA08_P) ; port S_IN_PS
SCL_SFP_0: IC8.6(SC0) RN2#1.6 ; port SCL_SFP_0  [project net SCL0]
SCL_SFP_1: IC8.10(SC1) R49.2 ; port SCL_SFP_1  [project net SCL1]
SDA_SFP_0: IC8.5(SD0) RN2#1.7 ; port SDA_SFP_0  [project net SDA0]
SDA_SFP_1: IC8.9(SD1) R48.2 ; port SDA_SFP_1  [project net SDA1]
SDO_PS: J4.G16(LA12_N) ; port SDO_PS
NetC67_2: C67.2 J5.1
NetC68_2: C68.2 J6.1
NetIC7_7: IC7.7(~{WC}) R46.2
NetIC8_4: IC8.4(~{INT0}) RN2#1.8
NetIC8_8: IC8.8(~{INT1}) RN2#1.5
NetIC8_11: IC8.11(~{INT}) RN1.4
NetJ4_D30: J4.D30(TDI) J4.D31(TDO)

Not connected (* = marked no-connect by the designer): J4 A6(DP2_M2C_P) A7(DP2_M2C_N) A10(DP3_M2C_P) A11(DP3_M2C_N) A14(DP4_M2C_P) A15(DP4_M2C_N) A18(DP5_M2C_P) A19(DP5_M2C_N) A26(DP2_C2M_P) A27(DP2_C2M_N) A30(DP3_C2M_P) A31(DP3_C2M_N) A34(DP4_C2M_P) A35(DP4_C2M_N) A38(DP5_C2M_P) A39(DP5_C2M_N) B1(CLK_DIR) B4(DP9_M2C_P) B5(DP9_M2C_N) B8(DP8_M2C_P) B9(DP8_M2C_N) B12(DP7_M2C_P) B13(DP7_M2C_N) B16(DP6_M2C_P) B17(DP6_M2C_N) B24(DP9_C2M_P) B25(DP9_C2M_N) B28(DP8_C2M_P) B29(DP8_C2M_N) B32(DP7_C2M_P) B33(DP7_C2M_N) B36(DP6_C2M_P) B37(DP6_C2M_N) B40(RES0) C10(LA06_P) C11(LA06_N) C14(LA10_P) C15(LA10_N) C18(LA14_P) C19(LA14_N) C22(LA18_P) C23(LA18_N) C26(LA27_P) C27(LA27_N) D1(PG_C2M) D14(LA09_P) D15(LA09_N) D17(LA13_P) D18(LA13_N) D20(LA17_P_CC) D21(LA17_N_CC) D27(LA26_N) D29(TCK) D33(TMS) D34(TRST_L) E2(HA01_P_CC) E3(HA01_N_CC) E6(HA05_P) E7(HA05_N) E9(HA09_P) E10(HA09_N) E12(HA13_P) E13(HA13_N) E15(HA16_P) E16(HA16_N) E18(HA20_P) E19(HA20_N) E21(HB03_P) E22(HB03_N) E24(HB05_P) E25(HB05_N) E27(HB09_P) E28(HB09_N) E30(HB13_P) E31(HB13_N) E33(HB19_P) E34(HB19_N) E36(HB21_P) E37(HB21_N) F1(PG_M2C) F4(HA00_P_CC) F5(HA00_N_CC) F7(HA04_P) F8(HA04_N) F10(HA08_P) F11(HA08_N) F13(HA12_P) F14(HA12_N) F16(HA15_P) F17(HA15_N) F19(HA19_P) F20(HA19_N) F22(HB02_P) F23(HB02_N) F25(HB04_P) F26(HB04_N) F28(HB08_P) F29(HB08_N) F31(HB12_P) F32(HB12_N) F34(HB16_P) F35(HB16_N) F37(HB20_P) F38(HB20_N) G2(CLK1_M2C_P) G3(CLK1_M2C_N) G19(LA16_N) G21(LA20_P) G22(LA20_N) G24(LA22_P) G25(LA22_N) G27(LA25_P) G28(LA25_N) G30(LA29_P) G31(LA29_N) G33(LA31_P) G34(LA31_N) G36(LA33_P) G37(LA33_N) H1(VREF_A_M2C) H2(PRSNT_M2C_L) H16(LA11_P) H17(LA11_N) H22(LA19_P) H23(LA19_N) H28(LA24_P) H29(LA24_N) H31(LA28_P) H32(LA28_N) H34(LA30_P) H35(LA30_N) H37(LA32_P) H38(LA32_N) I2(CLK3_BIDIR_P) I3(CLK3_BIDIR_N) I6(HA03_P) I7(HA03_N) I9(HA07_P) I10(HA07_N) I12(HA11_P) I13(HA11_N) I15(HA14_P) I16(HA14_N) I18(HA18_P) I19(HA18_N) I21(HA22_P) I22(HA22_N) I24(HB01_P) I25(HB01_N) I27(HB07_P) I28(HB07_N) I30(HB11_P) I31(HB11_N) I33(HB15_P) I34(HB15_N) I36(HB18_P) I37(HB18_N) I39(VIO_B_M2C) J1(VREF_B_M2C) J4(CLK2_BIDIR_P) J5(CLK2_BIDIR_N) J7(HA02_P) J8(HA02_N) J10(HA06_P) J11(HA06_N) J13(HA10_P) J14(HA10_N) J16(HA17_P_CC) J17(HA17_N_CC) J19(HA21_P) J20(HA21_N) J22(HA23_P) J23(HA23_N) J25(HB00_P_CC) J26(HB00_N_CC) J28(HB06_P_CC) J29(HB06_N_CC) J31(HB10_P) J32(HB10_N) J34(HB14_P) J35(HB14_N) J37(HB17_P_CC) J38(HB17_N_CC) J40(VIO_B_M2C); RN1 1*

### Layout directives
differential pair: FPGA_RX0_C_N, FPGA_RX0_C_P, FPGA_RX1_C_N, FPGA_RX1_C_P, FPGA_TX0_N, FPGA_TX0_P, FPGA_TX1_N, FPGA_TX1_P, GT_REFCLK_AUX_N, GT_REFCLK_AUX_P
net class Back-Drill: GT_REFCLK_AUX_N, GT_REFCLK_AUX_P
net class Power: P3V3A, VADJ
net class 50ohm: NetC67_2, NetC68_2

### Notes on the sheet
- (near C65) FMC EPROM
- (near R46) I2C Addr: 10100|E1|E0|
- Level Shifting / Voltage Translator
- (near C66) I2C Mux
- (near RN1) 10kΩ
- (near IC8) I2C Addr: 1110011
- (near RN2#1) 10kΩ
- LA00 to LA33 (bancks 43-45 on Virtex) are referenced to VADJ (1.8V)
  GA0, GA1 are grounded. SCL, SDA (bank 64 on Virtex) are referenced to P3V3A
- Project/Equipment
- Document
- Designer
- Drawn by
- Check.by
- File
- Last Mod.
- Print Date
- Sheet
- Size
- A3
- of
- Rev

### Library data of the parts
C57-C68 = C0201-100nF-high-density: GRM033R61C104KE14; Vmax: 16V; Value: 100nF
IC7 = M24C02-RMN6TP: Integrated Circuit; Manufacturer_Name: STMicroelectronics; Datasheet Link: http://www.st.com/st-web-ui/static/active/en/resource/technical/document/datasheet/DM00071904.pdf; Height: 1.75mm; Manufacturer_Part_Number: M24C02-RMN6TP; Mouser Part Number: 511-M24C02-RMN6TP; Mouser Price/Stock: https://www.mouser.co.uk/ProductDetail/STMicroelectronics/M24C02-RMN6TP?qs=Jodr3Ka7a6ktinv3aZzndw%3D%3D; Arrow Part Number: M24C02-RMN6TP; Arrow Price/Stock: https://www.arrow.com/en/products/m24c02-rmn6tp/stmicroelectronics?region=nac
IC8 = TCA9543APWR: Integrated Circuit; Manufacturer_Name: Texas Instruments; Datasheet Link: http://www.ti.com/lit/gpn/tca9543a; Height: 1.2mm; Manufacturer_Part_Number: TCA9543APWR; Mouser Part Number: 595-TCA9543APWR; Mouser Price/Stock: https://www.mouser.co.uk/ProductDetail/Texas-Instruments/TCA9543APWR?qs=p08Uhw9w2Fzm36ZpNDVXHw%3D%3D; Arrow Part Number: TCA9543APWR; Arrow Price/Stock: https://www.arrow.com/en/products/tca9543apwr/texas-instruments?utm_currency=USD&region=europe
J4 = SEAM-40-03.5-S-10-2-A-K-TR: MF: Samtec; Value: *; Package: None; Price: None; MP: SEAM-40-03.5-S-10-2-A-K-TR; Availability: Unavailable
J5 J6 = SAMTEC_SMA-J-P-H-ST-MT1: Part Description: 50 Ohms SMA Straight Mixed Technology PCB Jack; Manufacturer: SAMTEC; PressFit: No; Sense Comment: assembly limitations; Part Number: SAMTEC_SMA-J-P-H-ST-MT1; Component Kind: Standard; Component Type: Standard; Pin Count: 5; Family: SMA; Mounted: Yes; Socket: No; SMD: Yes; Sense: Yes; Status: Not Recommended; Manufacturer Part Number: SMA-J-P-H-ST-MT1; ComponentHeight: 7.95mm; HelpURL: \\cern.ch\dfs\Applications\Altium\Datasheets\SAMTEC_SMA-J-P-H-ST-MT1.pdf; Author: CERN DEM HF; CreateDate: 5/24/2023; LatestRevisionDate: 5/24/2023
R44-R49 = R0201-100ohm-high-density: Resistor 10k; Value: 100Ω
RN1 RN2#1 = EXB-U18103JX: Resistor Network (8-Pin) 10k; Manufacturer_Name: Panasonic; Datasheet Link: https://industrial.panasonic.com/cdbs/www-data/pdf/AOC0000/AOC0000C20.pdf; Height: 0.45mm; Manufacturer_Part_Number: EXB-U18103JX; Mouser Part Number: 667-EXB-U18103JX; Mouser Price/Stock: https://www.mouser.com/Search/Refine.aspx?Keyword=667-EXB-U18103JX
TP6-TP8 = RCU-0C: as TP9 on sheet PLL; Package: None; Price: None; Value: *; MP: RCU-0C; Availability: Unavailable

## Sheet phase-shifters.SchDoc
size 420 x 297 mm; SheetNumber: 2; SheetTotal: 7
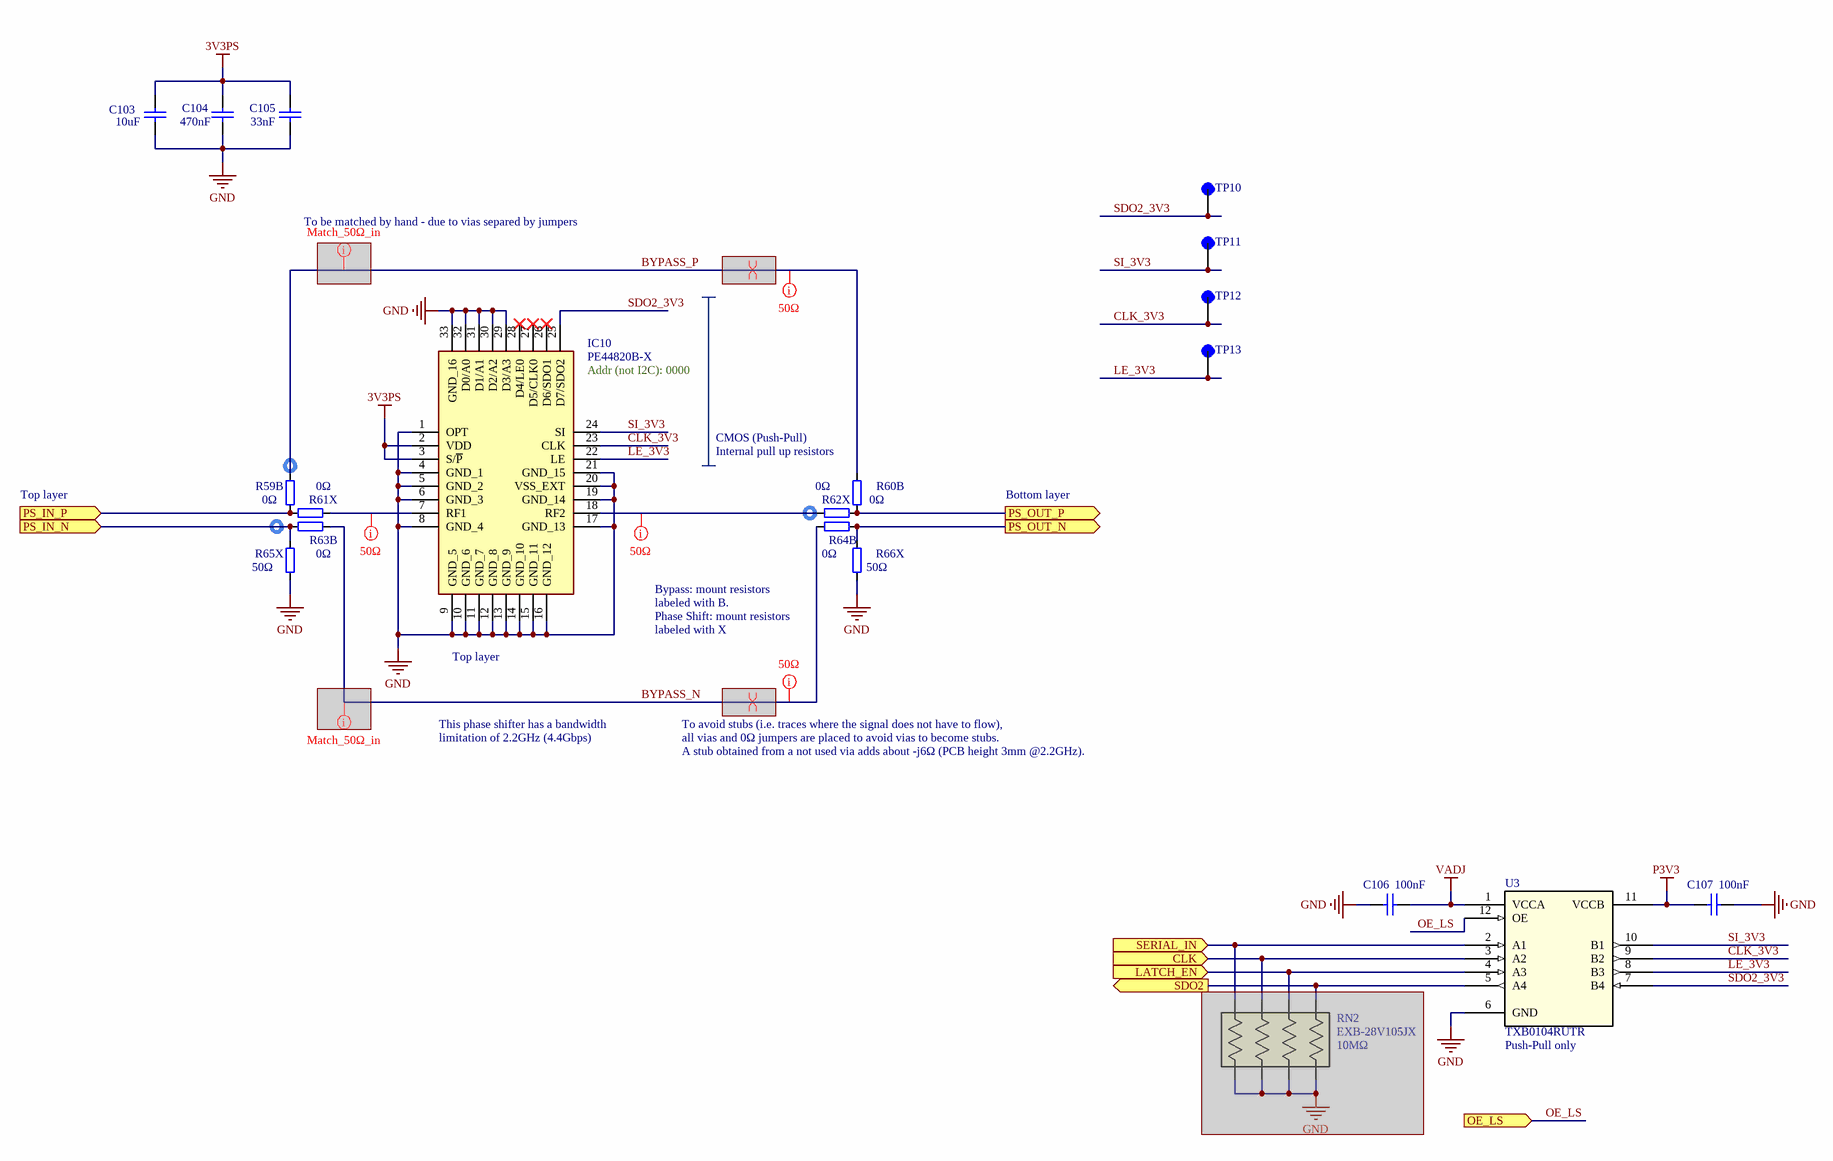
[diagram p6: phase-shifters.SchDoc]

### Parts
(Parts that share a designator on the sheet are numbered #1, #2 ... from top to bottom, then left to right.)
C103  10uF  [CAPC1608X87N]
C104  470nF  [CAPC0510X04N]
C105  33nF  [LLL03TR61E333KE01]
C106  100nF  [MURATA_HI_DENSITY_0201]
C107  100nF  [MURATA_HI_DENSITY_0201]
IC10  PE44820B-X  [QFN50P500X500X90-33N-D]
R59B  0Ω  [MURATA_HI_DENSITY_0201]
R60B  0Ω  [MURATA_HI_DENSITY_0201]
R61X  0Ω  [MURATA_HI_DENSITY_0201]
R62X  0Ω  [MURATA_HI_DENSITY_0201]
R63B  0Ω  [MURATA_HI_DENSITY_0201]
R64B  0Ω  [MURATA_HI_DENSITY_0201]
R65X  50Ω  [MURATA_HI_DENSITY_0201]
R66X  50Ω  [MURATA_HI_DENSITY_0201]
RN2#2  EXB-28V105JX  [EXB28V510JX]  (masked out: inside a compile mask, not in the netlist)
TP10  RCU-0C  [TP+195X110]  (value not drawn)
TP11  RCU-0C  [TP+195X110]  (value not drawn)
TP12  RCU-0C  [TP+195X110]  (value not drawn)
TP13  RCU-0C  [TP+195X110]  (value not drawn)
U3  TXB0104RUTR  [RUT12_TEX]

### Ports
CLK (in), LATCH_EN (in), OE_LS (in), PS_IN_N (in), PS_IN_P (in), PS_OUT_N (out), PS_OUT_P (out), SDO2 (out), SERIAL_IN (in)

### Nets
3V3PS: C103.2 C104.2 C105.2 IC10.2(VDD) IC10.3(S/~{P})
GND: C103.1 C104.1 C105.1 C106.1 C107.1 IC10.1(OPT) IC10.4(GND_1) IC10.5(GND_2) IC10.6(GND_3) IC10.8(GND_4) IC10.9(GND_5) IC10.10(GND_6) IC10.11(GND_7) IC10.12(GND_8) IC10.13(GND_9) IC10.14(GND_10) IC10.15(GND_11) IC10.16(GND_12) IC10.17(GND_13) IC10.19(GND_14) IC10.20(VSS_EXT) IC10.21(GND_15) IC10.29(D3/A3) IC10.30(D2/A2) IC10.31(D1/A1) IC10.32(D0/A0) IC10.33(GND_16) R65X.1 R66X.1 U3.6(GND)
P3V3: C107.2 U3.11(VCCB)
VADJ: C106.2 U3.1(VCCA)
BYPASS_N: R63B.1 R64B.2
BYPASS_P: R59B.2 R60B.2
CLK_3V3: IC10.23(CLK) TP12.1(TP) U3.9(B2)
CLK_PS: U3.3(A2) ; port CLK
FPGA_TX1_C_N: R63B.2 R65X.2 ; port PS_IN_N
FPGA_TX1_C_P: R59B.1 R61X.2 ; port PS_IN_P
FPGA_TX1_PS_N: R64B.1 R66X.2 ; port PS_OUT_N
FPGA_TX1_PS_P: R60B.1 R62X.1 ; port PS_OUT_P
LE_3V3: IC10.22(LE) TP13.1(TP) U3.8(B3)
LE_PS: U3.4(A3) ; port LATCH_EN
OE_LS: U3.12(OE) ; port OE_LS
S_IN_PS: U3.2(A1) ; port SERIAL_IN
SDO2_3V3: IC10.25(D7/SDO2) TP10.1(TP) U3.7(B4)
SDO_PS: U3.5(A4) ; port SDO2
SI_3V3: IC10.24(SI) TP11.1(TP) U3.10(B1)
NetIC10_7: IC10.7(RF1) R61X.1
NetIC10_18: IC10.18(RF2) R62X.2

Not connected (* = marked no-connect by the designer): IC10 26(D6/SDO1)* 27(D5/CLK0)* 28(D4/LE0)*

### Layout directives
differential pair: BYPASS_N, BYPASS_P
net class Match_50ohm_in: BYPASS_N, BYPASS_P
net class 50ohm: BYPASS_N, BYPASS_P, NetIC10_7, NetIC10_18

### Notes on the sheet
- To be matched by hand - due to vias separed by jumpers
- (near IC10) Addr (not I2C): 0000
- CMOS (Push-Pull)
- Top layer
- (near R60B) Internal pull up resistors
- Bottom layer
- Bypass: mount resistors labeled with B.
  Phase Shift: mount resistors labeled with X
- This phase shifter has a bandwidth limitation of 2.2GHz (4.4Gbps)
- To avoid stubs (i.e. traces where the signal does not have to flow),
  all vias and 0Ω jumpers are placed to avoid vias to become stubs.
  A stub obtained from a not used via adds about -j6Ω (PCB height 3mm @2.2GHz).
- (near RN2#2) 10MΩ
- (near U3) Push-Pull only
- Project/Equipment
- Document
- Designer
- Drawn by
- Check.by
- File
- Last Mod.
- Print Date
- Sheet
- Size
- A3
- of
- Rev

### Library data of the parts
C103 = CC0603_10UF_6.3V_20%_X5R: C1608X5R1E106M080AC; Part Description: SMD Multilayer Chip Ceramic Capacitor; Manufacturer: GENERIC; Manufacturer1 Part Number: C0603C106M9PAC; Voltage: 6.3V; TC: X5R; Tolerance: ±20%; Part Number: CC0603_10UF_6.3V_20%_X5R; Component Kind: Standard; Component Type: Standard; Pin Count: 2; Value: 10uF; Status: Preferred; Manufacturer Part Number: CC0603_10uF_6.3V_20%_X5R; Case: 0603; Mounted: Yes; Socket: No; SMD: Yes; Sense: No; Manufacturer1 Example: KEMET; Manufacturer1 ComponentHeight: 0.95mm; HelpURL: \\cern.ch\dfs\Applications\Altium\Datasheets\CC0603_X5R_KEMET.pdf; Author: CERN DEM JLC; CreateDate: 03/12/2007; LatestRevisionDate: 03/12/2007
C104 = Capacitor - non polarized: LLL153C70G474ME17; Value: 470nF
C105 = Capacitor - non polarized: LLL03TR61E333KE01; Value: 33nF
C106 C107 = C0201-100nF-high-density: GRM033R61C104KE14; Vmax: 16V; Value: 100nF
IC10 = PE44820B-X: Integrated Circuit; Manufacturer_Name: Peregrine Semiconductor; Datasheet Link: https://www.psemi.com/pdf/datasheets/pe44820ds.pdf; Height: 0.9mm; Manufacturer_Part_Number: PE44820B-X; Mouser Part Number: 81-PE44820B-X; Mouser Price/Stock: https://www.mouser.co.uk/ProductDetail/pSemi/PE44820B-X?qs=Cb2nCFKsA8prCrkfl5FDIQ%3D%3D
R59B R60B R61X R62X R63B R64B R65X R66X = R0201-100ohm-high-density: Resistor; Value: 100Ω
RN2#2 = EXB-28V105JX: Resistor Network; Manufacturer_Name: Panasonic; Datasheet Link: https://componentsearchengine.com/Datasheets/1/EXB-28V105JX.pdf; Height: 0mm; Manufacturer_Part_Number: EXB-28V105JX; Mouser Part Number: 667-EXB-28V105JX; Mouser Price/Stock: https://www.mouser.co.uk/ProductDetail/Panasonic/EXB-28V105JX?qs=cttFivMKqWzpuYBrjCbkjA%3D%3D; Arrow Part Number: EXB-28V105JX; Arrow Price/Stock: https://www.arrow.com/en/products/exb-28v105jx/panasonic
TP10-TP13 = RCU-0C: MF: {'manufacturer': u'TE Connectivity AMP Connectors'}; Package: None; Price: None; Value: *; MP: RCU-0C; Availability: Unavailable
U3 = TXB0104RUTR: No Description Available; Mfr_Name: Texas Instruments; RefDes: RefDes; Type: Type

## Nets that join several sheets
1V8: PLL (27 pins), l3 (17 pins), l2 (17 pins), l1 (17 pins), l0 (17 pins), power-sheet (6 pins)
3V3APLL: PLL (C87.2 IC9.13 R57.2), power-sheet (6 pins)
3V3PS: power-sheet (6 pins), phase-shifters (5 pins)
GND: SFP (67 pins), PLL (25 pins), l3 (15 pins), l2 (15 pins), l1 (15 pins), l0 (15 pins), power-sheet (61 pins), FMC (168 pins), phase-shifters (30 pins)
P3V3: SFP (8 pins), power-sheet (6 pins), FMC (11 pins), phase-shifters (C107.2 U3.11)
P12V: power-sheet (C21.1 C26.2 R7.2 U1.1), FMC (J4.C35 J4.C37 TP6.1)
VADJ: FMC (13 pins), phase-shifters (C106.2 U3.1)
VREFAC: l3 (C13_l3.2 IC1_l3.5 IC1_l3.8 IC1_l3.14), l2 (C13_l2.2 IC1_l2.5 IC1_l2.8 IC1_l2.14), l1 (C13_l1.2 IC1_l1.5 IC1_l1.8 IC1_l1.14), l0 (C13_l0.2 IC1_l0.5 IC1_l0.8 IC1_l0.14), power-sheet (R20.1 R23.2)
1V8_DIS: power-sheet (Q4.1 R27.1), FMC (J4.D26)
3V3_APLL_DIS: power-sheet (Q1.1 R4.1), FMC (J4.D23)
3V3_PS_DIS: power-sheet (Q3.1 R24.1), FMC (J4.D24)
ADJ_SCL: PLL (W5.2), FMC (IC8.12 J4.D8 RN1.3)
ADJ_SDA: PLL (W6.2), FMC (IC8.13 J4.D9 RN1.2)
BEAT_0_N: l0 (C11_l0.1), FMC (J4.H8)
BEAT_0_P: l0 (C10_l0.1), FMC (J4.H7)
BEAT_1_N: l1 (C11_l1.1), FMC (J4.H26)
BEAT_1_P: l1 (C10_l1.1), FMC (J4.H25)
BEAT_2_N: l2 (C11_l2.1), FMC (J4.H20)
BEAT_2_P: l2 (C10_l2.1), FMC (J4.H19)
BEAT_3_N: l3 (C11_l3.1), FMC (J4.H14)
BEAT_3_P: l3 (C10_l3.1), FMC (J4.H13)
CLK_PS: FMC (J4.G13), phase-shifters (U3.3)
CLN_RXUSRCLK_N: PLL (C70.2), FMC (J4.D5)
CLN_RXUSRCLK_P: PLL (C69.2), FMC (J4.D4)
DMTD_CLK_0_N: PLL (C80.2), l0 (IC1_l0.7)
DMTD_CLK_0_P: PLL (C78.2), l0 (IC1_l0.6)
DMTD_CLK_1_N: PLL (C86.2), l1 (IC1_l1.7)
DMTD_CLK_1_P: PLL (C85.2), l1 (IC1_l1.6)
DMTD_CLK_2_N: PLL (C84.2), l2 (IC1_l2.7)
DMTD_CLK_2_P: PLL (C83.2), l2 (IC1_l2.6)
DMTD_CLK_3_N: PLL (C82.2), l3 (IC1_l3.7)
DMTD_CLK_3_P: PLL (C81.2), l3 (IC1_l3.6)
DMTD_CLK_FPGA_N: PLL (C92.2), FMC (J4.H5)
DMTD_CLK_FPGA_P: PLL (C91.2), FMC (J4.H4)
EQ0_EN: l0 (IC2_l0.5), FMC (J4.H10)
EQ1_EN: l1 (IC2_l1.5), FMC (J4.G10)
EQ2_EN: l2 (IC2_l2.5), FMC (J4.G9)
EQ3_EN: l3 (IC2_l3.5), FMC (J4.H11)
FPGA_RX0_N: l0 (IC2_l0.9), FMC (C62.2)
FPGA_RX0_P: l0 (IC2_l0.10), FMC (C61.2)
FPGA_RX1_N: l2 (IC2_l2.9), FMC (C64.2)
FPGA_RX1_P: l2 (IC2_l2.10), FMC (C63.2)
FPGA_TX0_C_N: l3 (IC2_l3.4), FMC (C58.1)
FPGA_TX0_C_P: l3 (IC2_l3.1), FMC (C57.1)
FPGA_TX1_C_N: FMC (C60.1), phase-shifters (R63B.2 R65X.2)
FPGA_TX1_C_P: FMC (C59.1), phase-shifters (R59B.1 R61X.2)
FPGA_TX1_PS_N: l1 (IC2_l1.4), phase-shifters (R64B.1 R66X.2)
FPGA_TX1_PS_P: l1 (IC2_l1.1), phase-shifters (R60B.1 R62X.1)
LE_PS: FMC (J4.G15), phase-shifters (U3.4)
OE_LS: FMC (IC8.3 J4.G18 R47.2), phase-shifters (U3.12)
PLL_Lock: PLL (IC9.47 R58.1 TP9.1), FMC (J4.D11)
PLL_RSTb: PLL (IC9.6), FMC (J4.D12)
RXUSRCLK_N: PLL (C79.2), FMC (J4.G7)
RXUSRCLK_P: PLL (C77.2), FMC (J4.G6)
S_IN_PS: FMC (J4.G12), phase-shifters (U3.2)
SCL0: SFP (J2.5), FMC (IC8.6 RN2#1.6)
SCL1: SFP (J3.5), FMC (IC8.10 R49.2)
SDA0: SFP (J2.4), FMC (IC8.5 RN2#1.7)
SDA1: SFP (J3.4), FMC (IC8.9 R48.2)
SDO_PS: FMC (J4.G16), phase-shifters (U3.5)
SFP_RX0_N: SFP (J2.12), l0 (IC2_l0.4)
SFP_RX0_P: SFP (J2.13), l0 (IC2_l0.1)
SFP_RX1_N: SFP (J3.12), l2 (IC2_l2.4)
SFP_RX1_P: SFP (J3.13), l2 (IC2_l2.1)
SFP_TX0_N: SFP (J2.19), l3 (IC2_l3.9)
SFP_TX0_P: SFP (J2.18), l3 (IC2_l3.10)
SFP_TX1_N: SFP (J3.19), l1 (IC2_l1.9)
SFP_TX1_P: SFP (J3.18), l1 (IC2_l1.10)